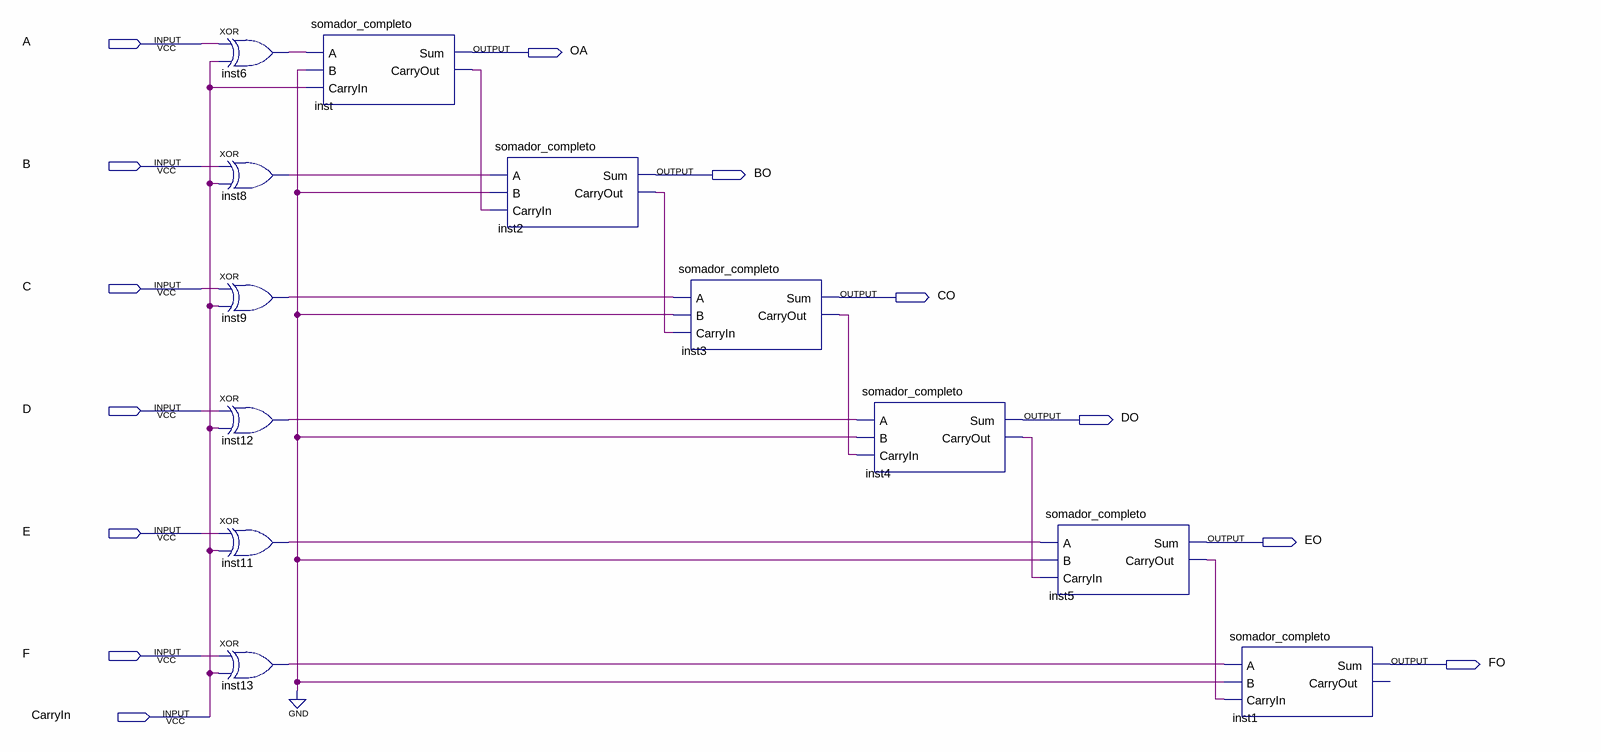
[diagram p0: schematic sheet]
// Quartus schematic complemento_de_dois.bdf as structural Verilog: 12 symbols, 13 pins
module complemento_de_dois (
  input  A,
  input  B,
  input  C,
  input  D,
  input  E,
  input  F,
  input  CarryIn,
  output OA,
  output BO,
  output CO,
  output DO,
  output EO,
  output FO
);

  wire inst2_carryout, inst3_carryout, inst4_carryout, inst5_carryout, inst6_out, inst8_out, inst9_out,
       inst11_out, inst12_out, inst13_out, inst_carryout;

  xor inst6 (inst6_out, A, CarryIn);
  xor inst8 (inst8_out, B, CarryIn);
  xor inst9 (inst9_out, C, CarryIn);
  xor inst12 (inst12_out, D, CarryIn);
  xor inst11 (inst11_out, E, CarryIn);
  xor inst13 (inst13_out, F, CarryIn);
  somador_completo inst (.A(inst6_out), .B(1'b0), .CarryIn(CarryIn), .Sum(OA), .CarryOut(inst_carryout));
  somador_completo inst2 (.A(inst8_out), .B(1'b0), .CarryIn(inst_carryout), .Sum(BO), .CarryOut(inst2_carryout));
  somador_completo inst3 (.A(inst9_out), .B(1'b0), .CarryIn(inst2_carryout), .Sum(CO), .CarryOut(inst3_carryout));
  somador_completo inst4 (.A(inst12_out), .B(1'b0), .CarryIn(inst3_carryout), .Sum(DO), .CarryOut(inst4_carryout));
  somador_completo inst5 (.A(inst11_out), .B(1'b0), .CarryIn(inst4_carryout), .Sum(EO), .CarryOut(inst5_carryout));
  somador_completo inst1 (.A(inst13_out), .B(1'b0), .CarryIn(inst5_carryout), .Sum(FO));  // open: CarryOut
endmodule
